# EAGLE schematic SFH 2430 Breakout (EAGLE 8.2.1)
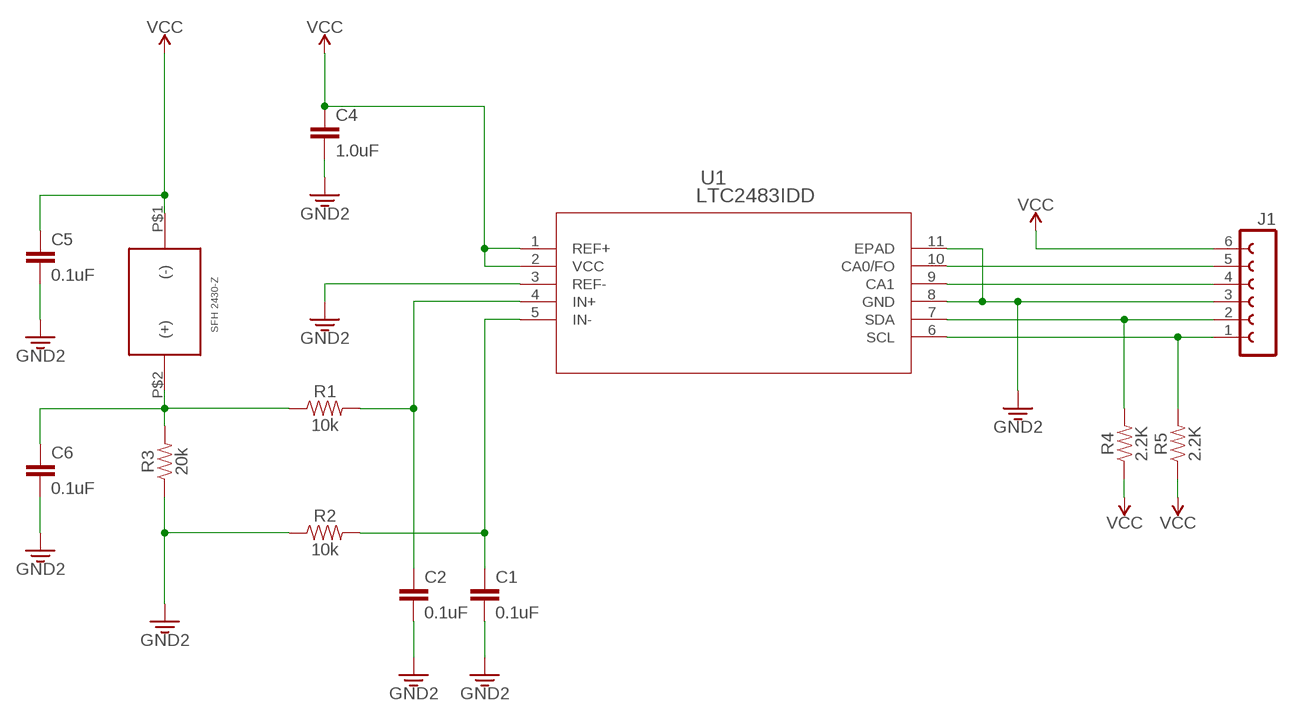
[diagram p0: schematic, sheet 1]

## Parts
C1  0.1uF  0.1UF-0603-25V-5%  [0603]
C2  0.1uF  0.1UF-0603-25V-5%  [0603]
C4  1.0uF  1.0UF-0805-25V-10%  [0805]
C5  0.1uF  0.1UF-0603-100V-10%  [0603]
C6  0.1uF  0.1UF-0603-100V-10%  [0603]
J1  FE06-1  [FE06]
R1  10k  RESISTOR0805  [0805]
R2  10k  RESISTOR0805  [0805]
R3  20k  RESISTOR0805  [0805]
R4  2.2K  RESISTOR0805  [0805]
R5  2.2K  RESISTOR0805  [0805]
U1  LTC2483IDD  [DFN-10_DD]
U$1  SFH-2430-Z  [DIL]

## Nets
GND: C1.2 C2.2 C4.2 C5.2 C6.2 J1.3 R2.1 R3.1 U1.3(REF-) U1.8(GND) U1.11(EPAD) ; supply symbol labelled GND2
N$1: J1.1 R5.2 U1.6(SCL)
N$2: C1.1 R2.2 U1.5(IN-)
N$3: C2.1 R1.2 U1.4(IN+)
N$4: J1.2 R4.2 U1.7(SDA)
N$6: J1.4 U1.9(CA1)
N$7: J1.5 U1.10(CA0/FO)
N$8: C6.1 R1.1 R3.2 U$1.P$2((+))
VCC: C4.1 C5.1 J1.6 R4.1 R5.1 U1.1(REF+) U1.2(VCC) U$1.P$1((-))

## Library data of the parts
C1 C2 = SparkFun-Capacitors:0.1UF: 0.1µF ceramic capacitors A capacitor is a passive two-terminal electrical component used to store electrical energy temporarily in an electric field.; PROD_ID: CAP-08604
C4 = SparkFun-Capacitors:1.0UF: 1µF ceramic capacitors A capacitor is a passive two-terminal electrical component used to store electrical energy temporarily in an electric field.; PROD_ID: CAP-08064
C5 C6 = SparkFun-Capacitors:0.1UF: 0.1µF ceramic capacitors A capacitor is a passive two-terminal electrical component used to store electrical energy temporarily in an electric field.; PROD_ID: CAP-08390
J1 = con-lsta:FE06-1: FEMALE HEADER; OC_FARNELL: unknown; OC_NEWARK: unknown
R1-R5 = SparkFun-Resistors:RESISTOR: Generic Resistor Package
U1 = LTC2483idd:LTC2483IDD; MANUFACTURER_PART_NUMBER: ltc2483idd; VENDOR: Linear Technology
U$1 = SFH 2430 Z:SFH-2430-Z